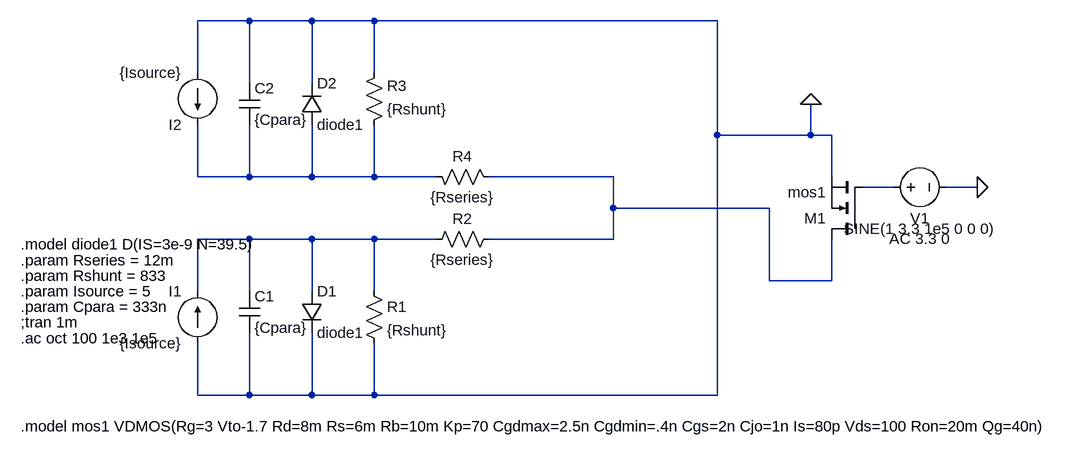
[diagram p0: schematic module-simple.asc]
module-simple.asc, the LTspice schematic file:
Version 4
SHEET 1 1844 680
WIRE 64 -304 -16 -304
WIRE 160 -304 64 -304
WIRE 256 -304 160 -304
WIRE 784 -304 256 -304
WIRE -16 -224 -16 -304
WIRE 256 -224 256 -304
WIRE 64 -208 64 -304
WIRE 160 -208 160 -304
WIRE 784 -128 784 -304
WIRE 928 -128 928 -176
WIRE 928 -128 784 -128
WIRE 960 -128 928 -128
WIRE -16 -64 -16 -144
WIRE 64 -64 64 -144
WIRE 64 -64 -16 -64
WIRE 160 -64 160 -144
WIRE 160 -64 64 -64
WIRE 256 -64 256 -144
WIRE 256 -64 160 -64
WIRE 352 -64 256 -64
WIRE 624 -64 432 -64
WIRE 960 -64 960 -128
WIRE 1056 -48 1008 -48
WIRE 1184 -48 1136 -48
WIRE 624 -16 624 -64
WIRE 864 -16 624 -16
WIRE 64 32 -16 32
WIRE 160 32 64 32
WIRE 256 32 160 32
WIRE 352 32 256 32
WIRE 624 32 624 -16
WIRE 624 32 432 32
WIRE 864 96 864 -16
WIRE 960 96 960 32
WIRE 960 96 864 96
WIRE -16 112 -16 32
WIRE 64 112 64 32
WIRE 160 112 160 32
WIRE 256 112 256 32
WIRE -16 272 -16 192
WIRE 64 272 64 176
WIRE 64 272 -16 272
WIRE 160 272 160 176
WIRE 160 272 64 272
WIRE 256 272 256 192
WIRE 256 272 160 272
WIRE 784 272 784 -128
WIRE 784 272 256 272
FLAG 1184 -48 0
FLAG 928 -176 0
SYMBOL current -16 192 R180
WINDOW 0 24 80 Left 2
WINDOW 3 24 0 Left 2
WINDOW 123 0 0 Left 2
WINDOW 39 0 0 Left 2
SYMATTR InstName I1
SYMATTR Value {Isource}
SYMBOL cap 48 112 R0
SYMATTR InstName C1
SYMATTR Value {Cpara}
SYMBOL diode 144 112 R0
SYMATTR InstName D1
SYMATTR Value diode1
SYMBOL res 240 96 R0
SYMATTR InstName R1
SYMATTR Value {Rshunt}
SYMBOL res 448 16 R90
WINDOW 0 0 56 VBottom 2
WINDOW 3 32 56 VTop 2
SYMATTR InstName R2
SYMATTR Value {Rseries}
SYMBOL nmos 1008 32 R180
SYMATTR InstName M1
SYMATTR Value mos1
SYMBOL voltage 1040 -48 R270
WINDOW 0 -32 56 VBottom 2
WINDOW 3 -48 56 VBottom 2
WINDOW 123 -64 56 VBottom 2
WINDOW 39 0 0 Left 2
SYMATTR InstName V1
SYMATTR Value SINE(1 3.3 1e5 0 0 0)
SYMATTR Value2 AC 3.3 0
SYMBOL current -16 -224 M0
WINDOW 0 24 80 Left 2
WINDOW 3 24 0 Left 2
WINDOW 123 0 0 Left 2
WINDOW 39 0 0 Left 2
SYMATTR InstName I2
SYMATTR Value {Isource}
SYMBOL cap 48 -144 M180
WINDOW 0 24 56 Left 2
WINDOW 3 24 8 Left 2
SYMATTR InstName C2
SYMATTR Value {Cpara}
SYMBOL diode 144 -144 M180
WINDOW 0 24 64 Left 2
WINDOW 3 24 0 Left 2
SYMATTR InstName D2
SYMATTR Value diode1
SYMBOL res 240 -128 M180
WINDOW 0 36 76 Left 2
WINDOW 3 36 40 Left 2
SYMATTR InstName R3
SYMATTR Value {Rshunt}
SYMBOL res 448 -48 M270
WINDOW 0 32 56 VTop 2
WINDOW 3 0 56 VBottom 2
SYMATTR InstName R4
SYMATTR Value {Rseries}
TEXT -288 40 Left 2 !.model diode1 D(IS=3e-9 N=39.5)
TEXT -288 160 Left 2 !;tran 1m
TEXT -288 88 Left 2 !.param Rshunt = 833
TEXT -288 64 Left 2 !.param Rseries = 12m
TEXT -288 136 Left 2 !.param Cpara = 333n
TEXT -288 112 Left 2 !.param Isource = 5
TEXT -288 320 Left 2 !.model mos1 VDMOS(Rg=3 Vto-1.7 Rd=8m Rs=6m Rb=10m Kp=70 Cgdmax=2.5n Cgdmin=.4n Cgs=2n Cjo=1n Is=80p Vds=100 Ron=20m Qg=40n)
TEXT -288 184 Left 2 !.ac oct 100 1e3 1e5

The netlist it stands for:
* module-simple.asc
I1 0 N004 {Isource}
C1 N004 0 {Cpara}
D1 N004 0 diode1
R1 N004 0 {Rshunt}
R2 N002 N004 {Rseries}
M1 N002 N003 0 0 mos1
V1 N003 0 SINE(1 3.3 1e5 0 0 0) AC 3.3 0
I2 0 N001 {Isource}
C2 N001 0 {Cpara}
D2 N001 0 diode1
R3 N001 0 {Rshunt}
R4 N002 N001 {Rseries}
.model D D
.lib standard.dio
.model NMOS NMOS
.model PMOS PMOS
.lib standard.mos
.model diode1 D(IS=3e-9 N=39.5)
;tran 1m
.param Rshunt = 833
.param Rseries = 12m
.param Cpara = 333n
.param Isource = 5
.model mos1 VDMOS(Rg=3 Vto-1.7 Rd=8m Rs=6m Rb=10m Kp=70 Cgdmax=2.5n Cgdmin=.4n Cgs=2n Cjo=1n Is=80p Vds=100 Ron=20m Qg=40n)
.ac oct 100 1e3 1e5
.backanno
.end